# EasyEDA Pro project 测试用途.eprj, schematic Schematic2
Board Name: Board2; Create Date: 2025-08-31; Page Name: P1; Project Name: 测试用途; Schematic Name: Schematic2; Update Date: 2025-09-03; Company: 嘉立创EDA; Page Size: A4; Version: V1.0
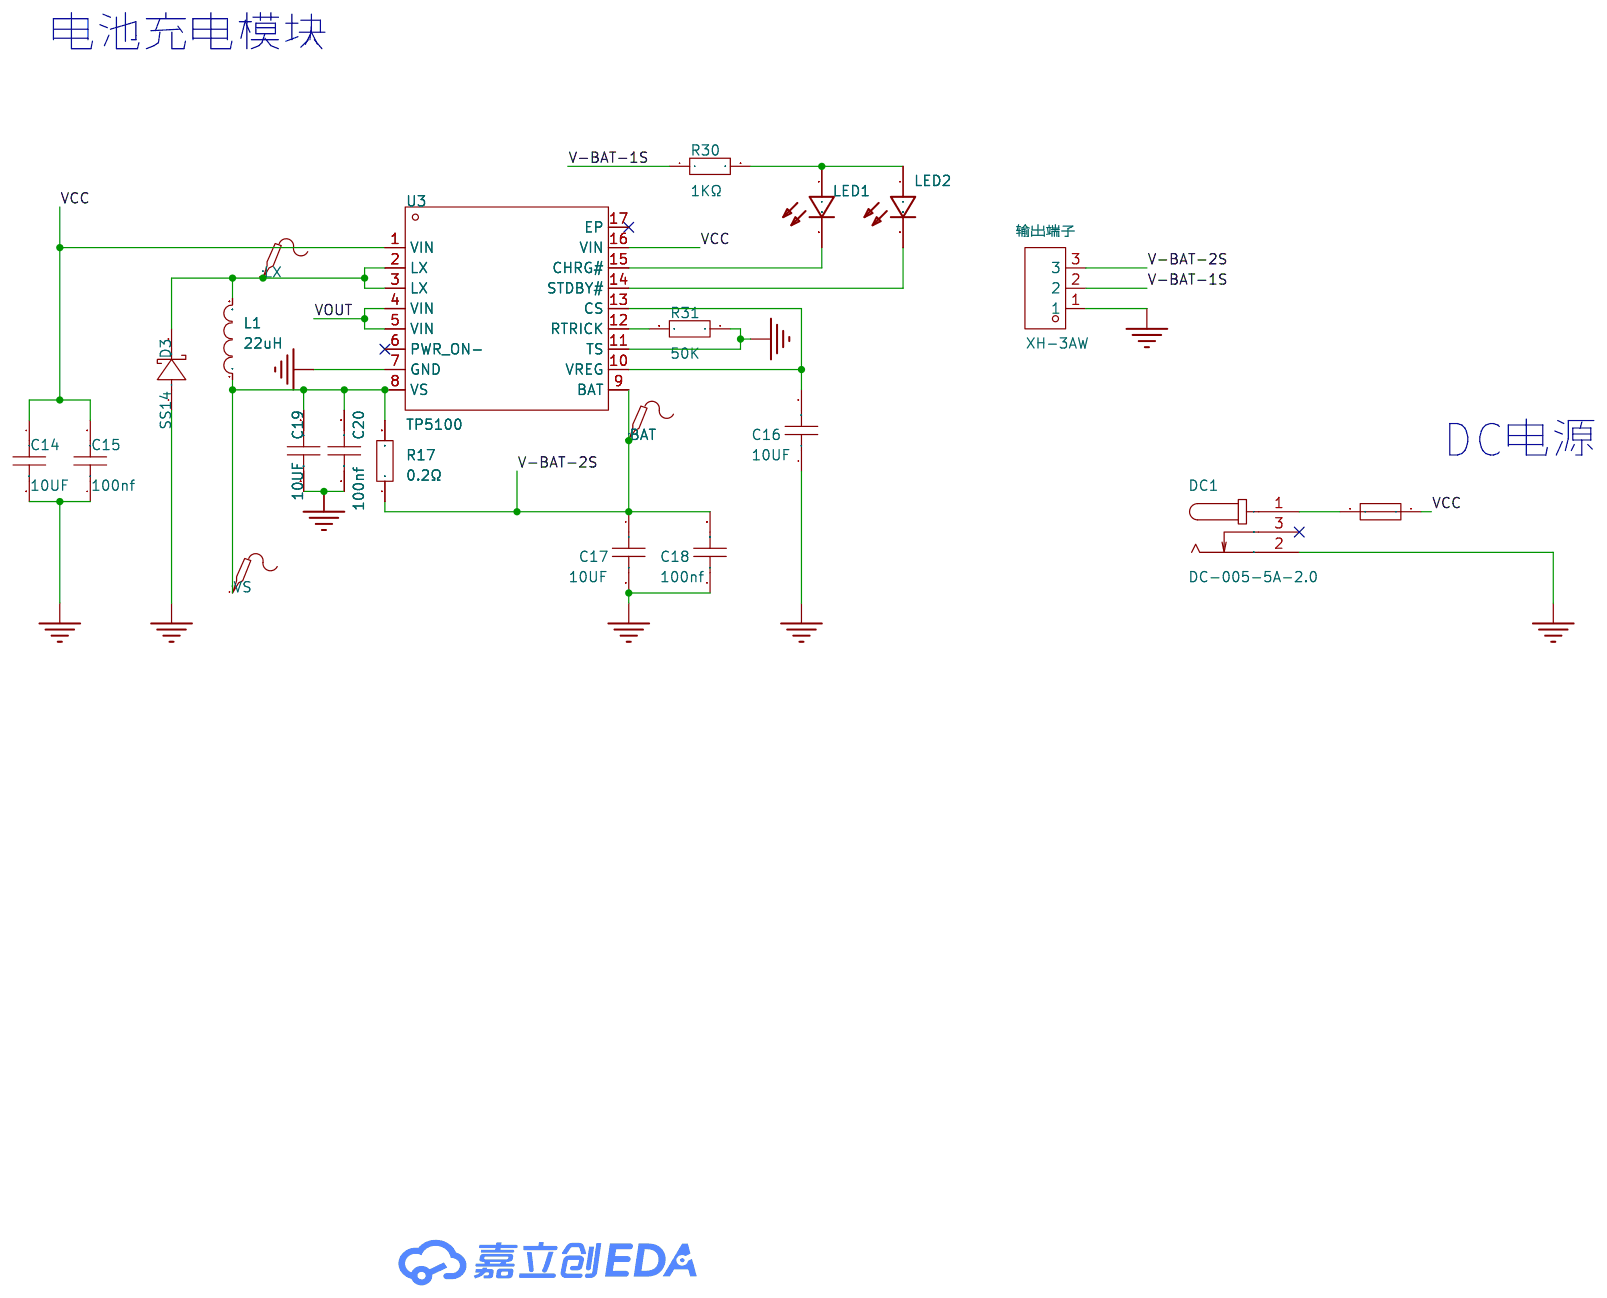
[diagram p1: schematic sheet]

## Parts
BAT  -  [Test-Point-0.5mm]
C14  10UF  [C1210]
C15  100nf  [C1206]
C16  10UF  [C1206]
C17  10UF  [C1210]
C18  100nf  [C1206]
C19  10UF  [C1210]
C20  100nf  [C1206]
D3  SS14  [SMA_L4.3-W2.6-LS5.0-FD]
DC1  DC-005-5A-2.0  [DC-IN-TH_DC-005-5A-2.0]
F1  SMD1206  [F1206]
L1  22uH  [IND-SMD_L12.0-W12.0_YPRH120X]
LED1  19-217/BHC-ZL1M2RY/3T  [LED0603-R-RD]
LED2  19-217/BHC-ZL1M2RY/3T  [LED0603-R-RD]
LX  -  [Test-Point-0.5mm]
R17  0.2Ω  [R1206]
R30  1KΩ  [R1206]
R31  50K  [R1206]
U3  TP5100  [TQFN-16_L4.0-W4.0-P0.65-BL-EP]
VS  -  [Test-Point-0.5mm]
输出端子  XH-3AW  [CONN-TH_3P-P2.54_HCTL_XH-3AW]

## Library data of the parts
BAT LX VS = Test-Point: Test Point 测试点
C14 C17 C19 = HGC1210R5476M250NSVK: 容值:47uF;精度:±20%;额定电压:25V;温度系数:X5R;; LCSC Part Name: 47uF ±20% 25V; Supplier Part: C7432791; Manufacturer: Chinocera(华瓷); Supplier Footprint: 1210; JLCPCB Part Class: 扩展库; Datasheet: https://atta.szlcsc.com/upload/public/pdf/source/20240320/FAC3FEC40A78BC5CCCE96C232A94D860.pdf; Supplier: LCSC; Tolerance: ±20%; Voltage Rating: 25V; Temperature Coefficient: X5R
C15 C16 C18 C20 = HGC1206R5106K500NSPJ: 容值:10uF;精度:±10%;额定电压:50V;温度系数:X5R;; LCSC Part Name: 10uF ±10% 50V; Supplier Part: C7432781; Manufacturer: Chinocera(华瓷); Supplier Footprint: 1206; JLCPCB Part Class: 扩展库; Datasheet: https://atta.szlcsc.com/upload/public/pdf/source/20240320/FAC3FEC40A78BC5CCCE96C232A94D860.pdf; Supplier: LCSC; Tolerance: ±10%; Voltage Rating: 50V; Temperature Coefficient: X5R
D3 = SS14_C7420316: 二极管配置:独立式;正向压降(Vf):550mV@1.0A;直流反向耐压(Vr):40V;整流电流:1A;; LCSC Part Name: 电压:40V 电流:1A; Supplier Part: C7420316; Manufacturer: 宏迦橙; Supplier Footprint: SMA(DO-214AC); JLCPCB Part Class: 扩展库; Datasheet: https://atta.szlcsc.com/upload/public/pdf/source/20230828/C73881E3299A0827586C2B1C18B17A53.pdf; Supplier: LCSC; Diode Configuration: 独立式; Forward Voltage (Vf@If): 550mV@1.0A; Reverse Voltage (Vr): 40V; Rectified Current: 1A; Reverse Leakage Current (Ir): 200uA@40V
DC1 = DC-005-5A-2.0: 连接器类型:DC电源插座;安装方式:弯插;触点内径:2mm;触点外径:6.2mm;额定电流:5A;额定电压:24V;工作温度范围:-20℃~+70℃;; LCSC Part Name: DC电源插座 内径:2mm 外径:6.2mm; Supplier Part: C381116; Manufacturer: XKB Connection(中国星坤); Supplier Footprint: 插件; JLCPCB Part Class: 扩展库; Datasheet: https://atta.szlcsc.com/upload/public/pdf/source/20211015/707A35F7AB6E89C57AAB641950105BB7.pdf; Supplier: LCSC; Connector Type: DC电源插座; Mounting Style: 弯插; Inside Contact Diameter: 2mm; Outside Contact Diameter: 6.2mm; Current Rating (Max): 5A; Voltage Rating (Max): 24V; Operating Temperature Range: -20℃~+70℃
F1 = SMD1206-150-16: 耐压(Vmax):16V;最大电流(Imax):40A;保持电流(Ihold):1.5A;跳闸电流(Itrip):3A;; Supplier Part: C46641031; Manufacturer: 宏嘉诚; Supplier Footprint: 1206; JLCPCB Part Class: 扩展库; Datasheet: https://atta.szlcsc.com/upload/public/pdf/source/20250414/5AC46D2F961B725C9DB708C91B04DBEC.pdf; Supplier: LCSC; Voltage - Max: 16V; Current - Max: 40A; Hold Current: 1.5A; Trip Current: 3A; Power Dissipation: 1W; Resistance - Initial (Ri) (Min): 25mΩ; Resistance - Post Trip (R1) (Max): 130mΩ; Time to Trip(Max): 300ms
L1 = YPRH1207-220M: 电感值:22uH;精度:±20%;额定电流:3.6A;; LCSC Part Name: 22uH ±20%; Supplier Part: C339950; Manufacturer: YJYCOIN(益嘉源); Supplier Footprint: SMD,12x12mm; JLCPCB Part Class: 扩展库; Datasheet: https://atta.szlcsc.com/upload/public/pdf/source/20200623/C339950_CB2CAFE108BC5DE837AA8F39C29DA454.pdf; Supplier: LCSC; Tolerance: ±20%; Rated Current: 3.6A; DC Resistance (DCR): 43mΩ
LED1 LED2 = 19-217/BHC-ZL1M2RY/3T: Supplier: LCSC; Manufacturer: EVERLIGHT; image: //image.lceda.cn/szlcsc/C72041.jpg; Supplier Part: C72041; JLCPCB Part Class: Basic; spicePre: L
R17 R30 R31 = 1206W4F1002T5E: 电阻类型:厚膜电阻;阻值:10kΩ;精度:±1%;功率:250mW;最大工作电压:200V;温度系数:±100ppm/℃;; LCSC Part Name: 10kΩ ±1% 250mW 厚膜电阻; Supplier Part: C17902; Manufacturer: UNI-ROYAL(厚声); Supplier Footprint: 1206; JLCPCB Part Class: 基础库; Datasheet: https://atta.szlcsc.com/upload/public/pdf/source/20200306/C422600_1E6D84923E4A46A82E41ADD87F860B5C.pdf; Supplier: LCSC; Type: 厚膜电阻; Tolerance: ±1%; Power(Watts): 250mW; Overload Voltage (Max): 200V; Temperature Coefficient: ±100ppm/℃; Operating Temperature Range: -55℃~+155℃
U3 = TP5100: Supplier Part: C379389; Manufacturer: TOPPOWER(南京拓微); Supplier Footprint: TQFN-16-EP(4x4); JLCPCB Part Class: 扩展库; Datasheet: https://atta.szlcsc.com/upload/public/pdf/source/20230625/310531CA6E48A76C009AF7A61C581768.pdf; Supplier: LCSC
输出端子 = XH-3AW_C2908612: 插针结构:1x3P;间距:2.54mm;安装方式:弯插;参考系列:XH;总PIN数:3P;排数:1;每排PIN数:3;行距:-;额定电流:3A;触头材质:黄铜;触头镀层:锡;工作温度范围:-25℃~+85℃;; LCSC Part Name: 1x3P 间距:2.54mm 弯插 系列:XH; Supplier Part: C2908612; Manufacturer: HCTL(华灿天禄); Supplier Footprint: 弯插,P=2.5mm; JLCPCB Part Class: 扩展库; Datasheet: https://atta.szlcsc.com/upload/public/pdf/source/20230711/B565BAF3B11666EF6B81B3605408F2BD.pdf; Supplier: LCSC; Pins Structure: 1x3P; Pitch: 2.54mm; Mounting Style: 弯插; Reference Series: XH; Number of Pins: 3P; Number of Rows: 1; Number of PINs Per Row: 3; Current Rating (Max): 3A; Contact Material: 黄铜; Contact Plating: 锡; Operating Temperature Range: -25℃~+85℃

## Nets
GND: C14.2 C15.1 C16.1 C17.2 C18.1 C19.2 C20.1 D3.1(A) DC1.2 R31.1 U3.7(GND) U3.11(TS) 输出端子.1
VCC: C14.1 C15.2 F1.1 U3.1(VIN) U3.16(VIN)
V-BAT-1S: R30.1 输出端子.2
V-BAT-2S: BAT.1 C17.1 C18.2 R17.1 U3.9(BAT) 输出端子.3
VOUT: U3.4(VIN) U3.5(VIN)
$1N694: D3.2(K) L1.2 LX.1 U3.2(LX) U3.3(LX)
$1N699: C16.2 U3.10(VREG) U3.13(CS)
$1N702: C19.1 C20.2 L1.1 R17.2 U3.8(VS) VS.1
$1N712: R31.2 U3.12(RTRICK)
Net-(DC1-1): DC1.1 F1.2
Net-(LED1-1): LED1.1(A) LED2.1(A) R30.2
Net-(LED1-2): LED1.2(C) U3.15(CHRG#)
Net-(LED2-2): LED2.2(C) U3.14(STDBY#)

Not connected (* = marked no-connect by the designer): DC1 3*; U3 6(PWR_ON-)* 17(EP)*

## Notes on the sheet
- 电池充电模块
- DC电源
